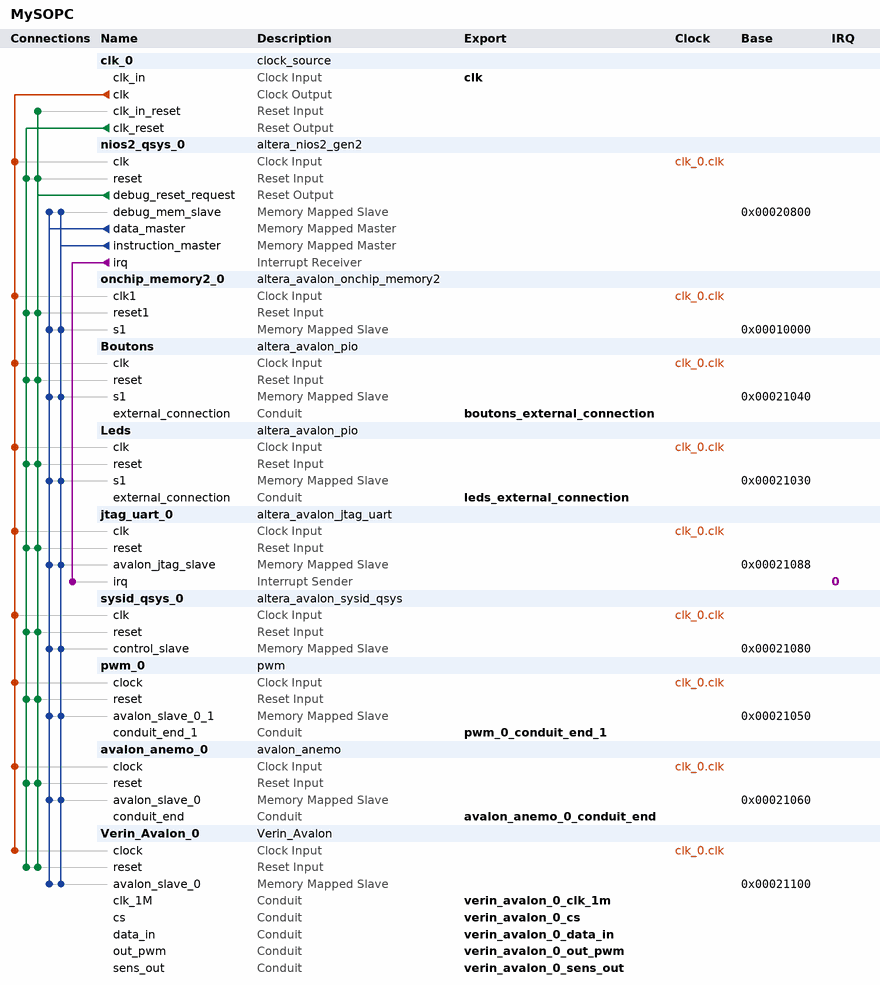
[diagram p0: system contents]
# Platform Designer (Qsys) system MySOPC, Cyclone IV E EP4CE22F17C6
# Parameters at their usual value, and those the tool derives, are not listed.
package require -exact qsys 18.1
create_system MySOPC
set_project_property DEVICE_FAMILY {Cyclone IV E}
set_project_property DEVICE EP4CE22F17C6

add_instance clk_0 clock_source 18.1
set_instance_parameter_value clk_0 clockFrequency 50000000

add_instance nios2_qsys_0 altera_nios2_gen2 18.1
set_instance_parameter_value nios2_qsys_0 dcache_size 2048
set_instance_parameter_value nios2_qsys_0 exceptionSlave onchip_memory2_0.s1
set_instance_parameter_value nios2_qsys_0 icache_size 4096
set_instance_parameter_value nios2_qsys_0 impl Tiny
set_instance_parameter_value nios2_qsys_0 resetSlave onchip_memory2_0.s1
set_instance_parameter_value nios2_qsys_0 setting_activateTrace true

add_instance onchip_memory2_0 altera_avalon_onchip_memory2 18.1
set_instance_parameter_value onchip_memory2_0 dataWidth 32
set_instance_parameter_value onchip_memory2_0 dualPort false
set_instance_parameter_value onchip_memory2_0 initMemContent true
set_instance_parameter_value onchip_memory2_0 initializationFileName onchip_mem.hex
set_instance_parameter_value onchip_memory2_0 memorySize 48000

add_instance Boutons altera_avalon_pio 18.1
set_instance_parameter_value Boutons direction Input
set_instance_parameter_value Boutons width 2

add_instance Leds altera_avalon_pio 18.1
set_instance_parameter_value Leds direction Output
set_instance_parameter_value Leds width 8

add_instance jtag_uart_0 altera_avalon_jtag_uart 18.1
set_instance_parameter_value jtag_uart_0 simInteractiveOptions NO_INTERACTIVE_WINDOWS

add_instance sysid_qsys_0 altera_avalon_sysid_qsys 18.1
set_instance_parameter_value sysid_qsys_0 id 0

add_instance pwm_0 pwm 1.0

add_instance avalon_anemo_0 avalon_anemo 1.0

add_instance Verin_Avalon_0 Verin_Avalon 1.0

# connections
add_connection clk_0.clk avalon_anemo_0.clock clock
add_connection clk_0.clk Boutons.clk clock
add_connection clk_0.clk jtag_uart_0.clk clock
add_connection clk_0.clk Leds.clk clock
add_connection clk_0.clk nios2_qsys_0.clk clock
add_connection clk_0.clk onchip_memory2_0.clk1 clock
add_connection clk_0.clk pwm_0.clock clock
add_connection clk_0.clk sysid_qsys_0.clk clock
add_connection clk_0.clk Verin_Avalon_0.clock clock
add_connection clk_0.clk_reset avalon_anemo_0.reset reset
add_connection clk_0.clk_reset Boutons.reset reset
add_connection clk_0.clk_reset jtag_uart_0.reset reset
add_connection clk_0.clk_reset Leds.reset reset
add_connection clk_0.clk_reset nios2_qsys_0.reset reset
add_connection clk_0.clk_reset onchip_memory2_0.reset1 reset
add_connection clk_0.clk_reset pwm_0.reset reset
add_connection clk_0.clk_reset sysid_qsys_0.reset reset
add_connection clk_0.clk_reset Verin_Avalon_0.reset reset
add_connection nios2_qsys_0.debug_reset_request avalon_anemo_0.reset reset
add_connection nios2_qsys_0.debug_reset_request Boutons.reset reset
add_connection nios2_qsys_0.debug_reset_request clk_0.clk_in_reset reset
add_connection nios2_qsys_0.debug_reset_request jtag_uart_0.reset reset
add_connection nios2_qsys_0.debug_reset_request Leds.reset reset
add_connection nios2_qsys_0.debug_reset_request nios2_qsys_0.reset reset
add_connection nios2_qsys_0.debug_reset_request onchip_memory2_0.reset1 reset
add_connection nios2_qsys_0.debug_reset_request pwm_0.reset reset
add_connection nios2_qsys_0.debug_reset_request sysid_qsys_0.reset reset
add_connection nios2_qsys_0.debug_reset_request Verin_Avalon_0.reset reset
add_connection nios2_qsys_0.data_master avalon_anemo_0.avalon_slave_0 avalon
set_connection_parameter_value nios2_qsys_0.data_master/avalon_anemo_0.avalon_slave_0 baseAddress 0x00021060
add_connection nios2_qsys_0.data_master Boutons.s1 avalon
set_connection_parameter_value nios2_qsys_0.data_master/Boutons.s1 baseAddress 0x00021040
add_connection nios2_qsys_0.data_master jtag_uart_0.avalon_jtag_slave avalon
set_connection_parameter_value nios2_qsys_0.data_master/jtag_uart_0.avalon_jtag_slave baseAddress 0x00021088
add_connection nios2_qsys_0.data_master Leds.s1 avalon
set_connection_parameter_value nios2_qsys_0.data_master/Leds.s1 baseAddress 0x00021030
add_connection nios2_qsys_0.data_master nios2_qsys_0.debug_mem_slave avalon
set_connection_parameter_value nios2_qsys_0.data_master/nios2_qsys_0.debug_mem_slave baseAddress 0x00020800
add_connection nios2_qsys_0.data_master onchip_memory2_0.s1 avalon
set_connection_parameter_value nios2_qsys_0.data_master/onchip_memory2_0.s1 baseAddress 0x00010000
add_connection nios2_qsys_0.data_master pwm_0.avalon_slave_0_1 avalon
set_connection_parameter_value nios2_qsys_0.data_master/pwm_0.avalon_slave_0_1 baseAddress 0x00021050
add_connection nios2_qsys_0.data_master sysid_qsys_0.control_slave avalon
set_connection_parameter_value nios2_qsys_0.data_master/sysid_qsys_0.control_slave baseAddress 0x00021080
add_connection nios2_qsys_0.data_master Verin_Avalon_0.avalon_slave_0 avalon
set_connection_parameter_value nios2_qsys_0.data_master/Verin_Avalon_0.avalon_slave_0 baseAddress 0x00021100
add_connection nios2_qsys_0.instruction_master avalon_anemo_0.avalon_slave_0 avalon
set_connection_parameter_value nios2_qsys_0.instruction_master/avalon_anemo_0.avalon_slave_0 baseAddress 0x00021060
add_connection nios2_qsys_0.instruction_master Boutons.s1 avalon
set_connection_parameter_value nios2_qsys_0.instruction_master/Boutons.s1 baseAddress 0x00021040
add_connection nios2_qsys_0.instruction_master jtag_uart_0.avalon_jtag_slave avalon
set_connection_parameter_value nios2_qsys_0.instruction_master/jtag_uart_0.avalon_jtag_slave baseAddress 0x00021088
add_connection nios2_qsys_0.instruction_master Leds.s1 avalon
set_connection_parameter_value nios2_qsys_0.instruction_master/Leds.s1 baseAddress 0x00021030
add_connection nios2_qsys_0.instruction_master nios2_qsys_0.debug_mem_slave avalon
set_connection_parameter_value nios2_qsys_0.instruction_master/nios2_qsys_0.debug_mem_slave baseAddress 0x00020800
add_connection nios2_qsys_0.instruction_master onchip_memory2_0.s1 avalon
set_connection_parameter_value nios2_qsys_0.instruction_master/onchip_memory2_0.s1 baseAddress 0x00010000
add_connection nios2_qsys_0.instruction_master pwm_0.avalon_slave_0_1 avalon
set_connection_parameter_value nios2_qsys_0.instruction_master/pwm_0.avalon_slave_0_1 baseAddress 0x00021050
add_connection nios2_qsys_0.instruction_master sysid_qsys_0.control_slave avalon
set_connection_parameter_value nios2_qsys_0.instruction_master/sysid_qsys_0.control_slave baseAddress 0x00021080
add_connection nios2_qsys_0.instruction_master Verin_Avalon_0.avalon_slave_0 avalon
set_connection_parameter_value nios2_qsys_0.instruction_master/Verin_Avalon_0.avalon_slave_0 baseAddress 0x00021100
add_connection nios2_qsys_0.irq jtag_uart_0.irq interrupt
set_connection_parameter_value nios2_qsys_0.irq/jtag_uart_0.irq irqNumber 0

# exported interfaces
add_interface avalon_anemo_0_conduit_end conduit end
set_interface_property avalon_anemo_0_conduit_end EXPORT_OF avalon_anemo_0.conduit_end
add_interface boutons_external_connection conduit end
set_interface_property boutons_external_connection EXPORT_OF Boutons.external_connection
add_interface clk clock sink
set_interface_property clk EXPORT_OF clk_0.clk_in
add_interface leds_external_connection conduit end
set_interface_property leds_external_connection EXPORT_OF Leds.external_connection
add_interface pwm_0_conduit_end_1 conduit end
set_interface_property pwm_0_conduit_end_1 EXPORT_OF pwm_0.conduit_end_1
add_interface verin_avalon_0_clk_1m conduit end
set_interface_property verin_avalon_0_clk_1m EXPORT_OF Verin_Avalon_0.clk_1M
add_interface verin_avalon_0_cs conduit end
set_interface_property verin_avalon_0_cs EXPORT_OF Verin_Avalon_0.cs
add_interface verin_avalon_0_data_in conduit end
set_interface_property verin_avalon_0_data_in EXPORT_OF Verin_Avalon_0.data_in
add_interface verin_avalon_0_out_pwm conduit end
set_interface_property verin_avalon_0_out_pwm EXPORT_OF Verin_Avalon_0.out_pwm
add_interface verin_avalon_0_sens_out conduit end
set_interface_property verin_avalon_0_sens_out EXPORT_OF Verin_Avalon_0.sens_out

set_interconnect_requirement {$system} qsys_mm.clockCrossingAdapter HANDSHAKE
set_interconnect_requirement {$system} qsys_mm.enableEccProtection FALSE
set_interconnect_requirement {$system} qsys_mm.insertDefaultSlave FALSE
set_interconnect_requirement {$system} qsys_mm.maxAdditionalLatency 1

save_system MySOPC.qsys
